# EAGLE board wordclock-r3-4x6 (EAGLE 5.11), part 1 of 2
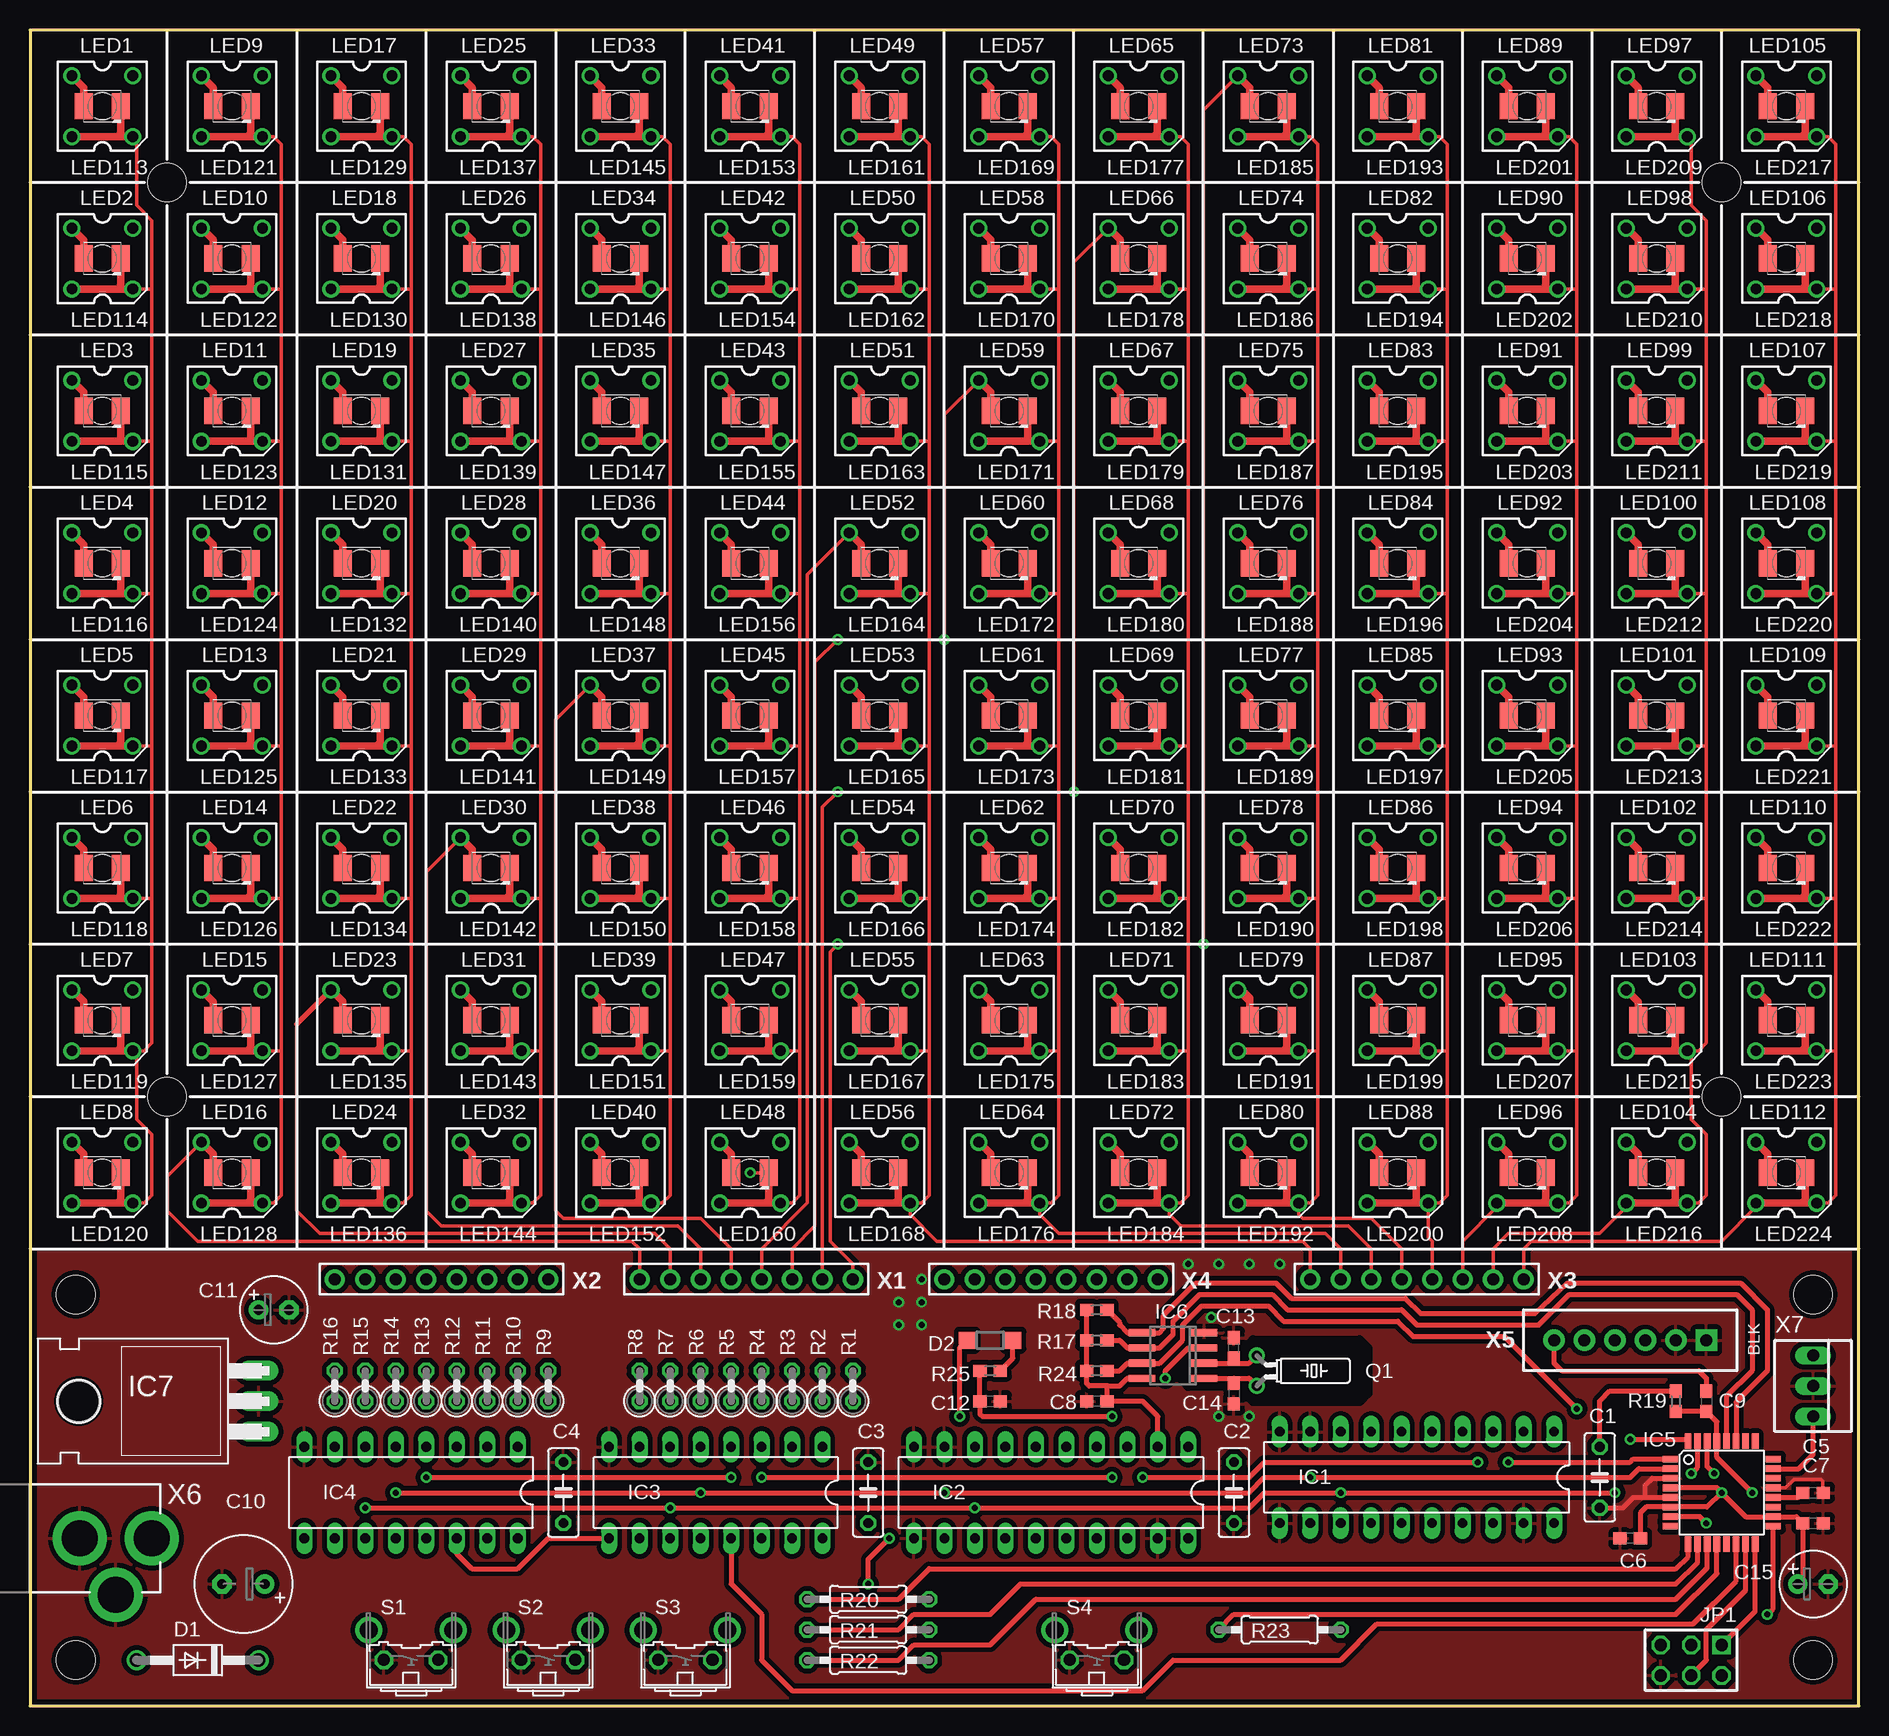
[diagram p2: board, top side]
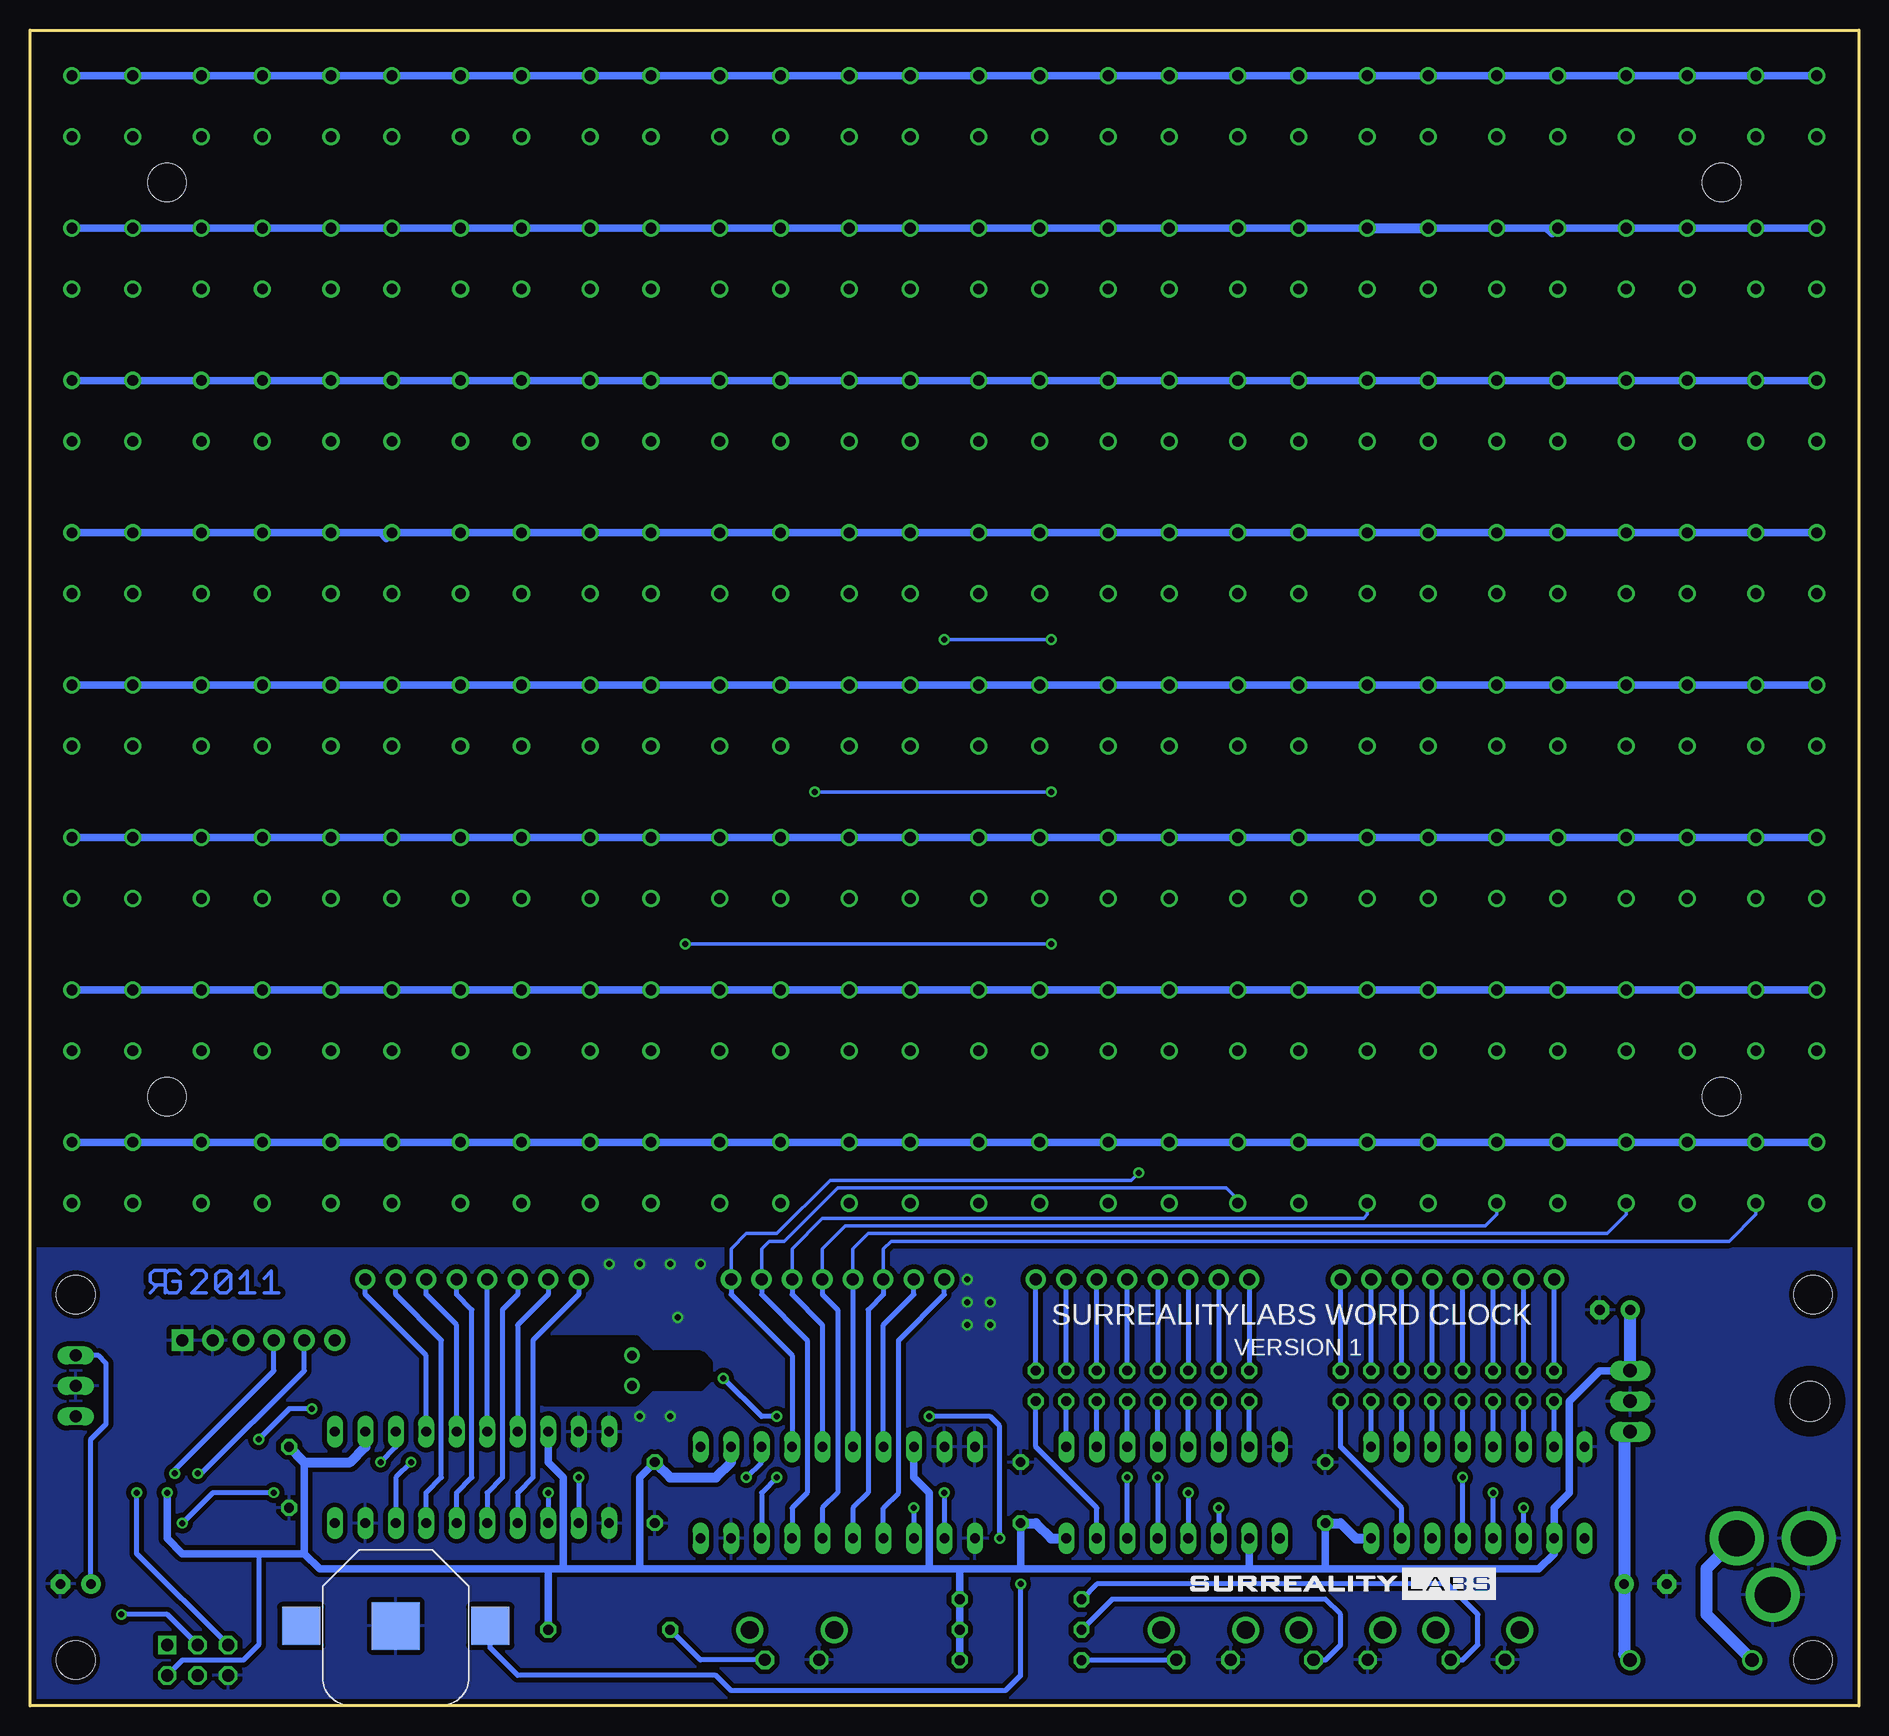
[diagram p3: board, bottom side, seen from below]

Size 152.4 x 139.7 mm. Coordinates in mm from the lower left corner, seen from the top.
Outline: 0,139.7 0,0 152.4,0 152.4,139.7 0,139.7
Copper layers (1*16): Top 0.035mm / dielectric 1.5mm / Bottom 0.035mm
Design rules "default *": minimum track width 10mil, minimum drill 19mil, track to track 10mil, track to pad 10mil, pad to pad 10mil, via to via 10mil, smd to smd 10mil, copper to edge 10mil, drill to drill 8mil, minimum pad ring 10mil, minimum via ring 8mil, stop-mask expansion 4mil, vias tented up to drill 20mil, thermal gap 16mil
Holes 3.2 mm at 3.81,34.29 148.59,34.29 148.59,3.81 3.81,3.81 11.43,50.8 140.97,50.8 140.97,127 11.43,127
tRestrict: 12 lines
bRestrict: 12 lines

## Footprints (pad centres in the part's own frame; a part is rotated, then mirrored left to right if it is on the bottom)
BATTCON_12MM = smd 3.962 x 3.962: GND 0,0 | smd 3.175 x 3.175: PWR@1 -7.874,0; PWR@2 7.874,0
C050-025X075 = drill 0.813 octagon: 1 -2.54,0; 2 2.54,0
C0603 = smd 1.1 x 1: 1 -0.85,0; 2 0.85,0
E3,5-8 = drill 0.813 pad 1.6 round: + -1.778,0 | drill 0.813 pad 1.6 octagon: - 1.778,0
E2,5-6 = drill 0.813 pad 1.6 round: + -1.27,0 | drill 0.813 pad 1.6 octagon: - 1.27,0
DO41-10 = drill 1.118 round: A 5.08,0; C -5.08,0
SOD123 = smd 1.4 x 1.4: A 1.9,0; C -1.9,0
DIL20 = drill 0.813 long: 1 -11.43,-3.81; 2 -8.89,-3.81; 3 -6.35,-3.81; 4 -3.81,-3.81; 5 -1.27,-3.81; 6 1.27,-3.81; 7 3.81,-3.81; 8 6.35,-3.81; 9 8.89,-3.81; 10 11.43,-3.81; 11 11.43,3.81; 12 8.89,3.81; 13 6.35,3.81; 14 3.81,3.81; 15 1.27,3.81; 16 -1.27,3.81; 17 -3.81,3.81; 18 -6.35,3.81; 19 -8.89,3.81; 20 -11.43,3.81
DIL16 = drill 0.813 long: 1 -8.89,-3.81; 2 -6.35,-3.81; 3 -3.81,-3.81; 4 -1.27,-3.81; 5 1.27,-3.81; 6 3.81,-3.81; 7 6.35,-3.81; 8 8.89,-3.81; 9 8.89,3.81; 10 6.35,3.81; 11 3.81,3.81; 12 1.27,3.81; 13 -1.27,3.81; 14 -3.81,3.81; 15 -6.35,3.81; 16 -8.89,3.81
TQFP32-08 = smd 1.27 x 0.559: 1 -4.293,2.8; 2 -4.293,2; 3 -4.293,1.2; 4 -4.293,0.4; 5 -4.293,-0.4; 6 -4.293,-1.2; 7 -4.293,-2; 8 -4.293,-2.8; 17 4.293,-2.8; 18 4.293,-2; 19 4.293,-1.2; 20 4.293,-0.4; 21 4.293,0.4; 22 4.293,1.2; 23 4.293,2; 24 4.293,2.8 | smd 0.559 x 1.27: 9 -2.8,-4.293; 10 -2,-4.293; 11 -1.2,-4.293; 12 -0.4,-4.293; 13 0.4,-4.293; 14 1.2,-4.293; 15 2,-4.293; 16 2.8,-4.293; 25 2.8,4.293; 26 2,4.293; 27 1.2,4.293; 28 0.4,4.293; 29 -0.4,4.293; 30 -1.2,4.293; 31 -2,4.293; 32 -2.8,4.293
SOIC8 = smd 0.6 x 2.2: 1 -1.905,-2.6; 2 -0.635,-2.6; 3 0.635,-2.6; 4 1.905,-2.6; 5 1.905,2.6; 6 0.635,2.6; 7 -0.635,2.6; 8 -1.905,2.6
TO220H = drill 1.118 long: 1 -2.54,-10.16; 2 0,-10.16; 3 2.54,-10.16 | hole 3.302: 0,4.826
AVR-ISP-6 = drill 1.016 square: 1 -2.54,-1.27 | drill 1.016 octagon: 2 -2.54,1.27; 3 0,-1.27; 4 0,1.27; 5 2.54,-1.27; 6 2.54,1.27
KA-3528ASYC = smd 1.5 x 2.2: A -1.55,0; C 1.55,0
SUPERFLUX-7.6X7.6 = drill 0.9 pad 1.422 round: 1 -2.54,2.54; 2 2.54,2.54; 3 -2.54,-2.54; 4 2.54,-2.54
TC26H = drill 0.813 round: 1 -1.27,0; 2 1.27,0
0207/2V = drill 0.813 octagon: 1 -1.27,0; 2 1.27,0
R0603 = smd 1.1 x 1: 1 -0.85,0; 2 0.85,0
0207/10 = drill 0.813 octagon: 1 -5.08,0; 2 5.08,0
B3F-31XX = drill 1.016 octagon: 1 -2.261,-1.245; 2 2.261,-1.245 | drill 1.499 pad 2.159 round: 3 -3.505,1.245; 4 3.505,1.245
100MIL-8 = drill 1 pad 1.676 round: 1 -8.89,0; 2 -6.35,0; 3 -3.81,0; 4 -1.27,0; 5 1.27,0; 6 3.81,0; 7 6.35,0; 8 8.89,0
USBCABLE-0.100-NOLBL = drill 1 pad 1.778 square: 1 0,-7.62 | drill 1 pad 1.778 round: 2 0,-5.08; 3 0,-2.54; 4 0,0; 5 0,2.54; 6 0,5.08
PJ-002 = drill 3 pad 4.5 round: 1 0,0; 2 0,6; 3 -4.7,3
22-23-2031 = drill 1 long: 1 -2.54,0; 2 0,0; 3 2.54,0

## Placement (x,y rotation side)
BAT1  [BATTCON_12MM]  121.92,6.67 180 bottom
C1  [C050-025X075]  130.81,19.05 270 top
C2  [C050-025X075]  100.33,17.78 270 top
C3  [C050-025X075]  69.85,17.78 90 top
C4  [C050-025X075]  44.45,17.78 90 top
C5  [C0603]  148.59,17.78 0 top
C6  [C0603]  133.35,13.97 180 top
C7  [C0603]  148.59,15.24 0 top
C8  [C0603]  88.9,25.4 180 top
C9  [C0603]  139.7,25.4 270 top
C10  100u  [E3,5-8]  17.78,10.16 180 top
C11  10u  [E2,5-6]  20.32,33.02 0 top
C12  [C0603]  80.01,25.4 0 top
C13  8p  [C0603]  100.33,29.84 90 top
C14  10p  [C0603]  100.33,26.04 270 top
C15  10u  [E2,5-6]  148.59,10.16 0 top
D1  1N4004  [DO41-10]  13.97,3.81 180 top
D2  MBR0520LT  [SOD123]  80.01,30.48 180 top
IC1  TPIC6B595  [DIL20]  115.57,19.05 180 top
IC2  TPIC6B595  [DIL20]  85.09,17.78 180 top
IC3  74HC595N  [DIL16]  57.15,17.78 180 top
IC4  74HC595N  [DIL16]  31.75,17.78 180 top
IC5  MEGA48/88/168-AU  [TQFP32-08]  140.97,17.78 0 top
IC6  DS1307Z  [SOIC8]  95.25,29.21 90 top
IC7  7805T  [TO220H]  8.89,25.4 90 top
JP1  AVR-ISP-6  [AVR-ISP-6]  138.43,3.81 180 top
LED1  [KA-3528ASYC]  6.03,133.35 0 top
LED2  [KA-3528ASYC]  6.03,120.65 0 top
LED3  [KA-3528ASYC]  6.03,107.95 0 top
LED4  [KA-3528ASYC]  6.03,95.25 0 top
LED5  [KA-3528ASYC]  6.03,82.55 0 top
LED6  [KA-3528ASYC]  6.03,69.85 0 top
LED7  [KA-3528ASYC]  6.03,57.15 0 top
LED8  [KA-3528ASYC]  6.03,44.45 0 top
LED9  [KA-3528ASYC]  16.83,133.35 0 top
LED10  [KA-3528ASYC]  16.83,120.65 0 top
LED11  [KA-3528ASYC]  16.83,107.95 0 top
LED12  [KA-3528ASYC]  16.83,95.25 0 top
LED13  [KA-3528ASYC]  16.83,82.55 0 top
LED14  [KA-3528ASYC]  16.83,69.85 0 top
LED15  [KA-3528ASYC]  16.83,57.15 0 top
LED16  [KA-3528ASYC]  16.83,44.45 0 top
LED17  [KA-3528ASYC]  27.62,133.35 0 top
LED18  [KA-3528ASYC]  27.62,120.65 0 top
LED19  [KA-3528ASYC]  27.62,107.95 0 top
LED20  [KA-3528ASYC]  27.62,95.25 0 top
LED21  [KA-3528ASYC]  27.62,82.55 0 top
LED22  [KA-3528ASYC]  27.62,69.85 0 top
LED23  [KA-3528ASYC]  27.62,57.15 0 top
LED24  [KA-3528ASYC]  27.62,44.45 0 top
LED25  [KA-3528ASYC]  38.42,133.35 0 top
LED26  [KA-3528ASYC]  38.42,120.65 0 top
LED27  [KA-3528ASYC]  38.42,107.95 0 top
LED28  [KA-3528ASYC]  38.42,95.25 0 top
LED29  [KA-3528ASYC]  38.42,82.55 0 top
LED30  [KA-3528ASYC]  38.42,69.85 0 top
LED31  [KA-3528ASYC]  38.42,57.15 0 top
LED32  [KA-3528ASYC]  38.42,44.45 0 top
LED33  [KA-3528ASYC]  49.21,133.35 0 top
LED34  [KA-3528ASYC]  49.21,120.65 0 top
LED35  [KA-3528ASYC]  49.21,107.95 0 top
LED36  [KA-3528ASYC]  49.21,95.25 0 top
LED37  [KA-3528ASYC]  49.21,82.55 0 top
LED38  [KA-3528ASYC]  49.21,69.85 0 top
LED39  [KA-3528ASYC]  49.21,57.15 0 top
LED40  [KA-3528ASYC]  49.21,44.45 0 top
LED41  [KA-3528ASYC]  60.01,133.35 0 top
LED42  [KA-3528ASYC]  60.01,120.65 0 top
LED43  [KA-3528ASYC]  60.01,107.95 0 top
LED44  [KA-3528ASYC]  60.01,95.25 0 top
LED45  [KA-3528ASYC]  60.01,82.55 0 top
LED46  [KA-3528ASYC]  60.01,69.85 0 top
LED47  [KA-3528ASYC]  60.01,57.15 0 top
LED48  [KA-3528ASYC]  60.01,44.45 0 top
LED49  [KA-3528ASYC]  70.8,133.35 0 top
LED50  [KA-3528ASYC]  70.8,120.65 0 top
LED51  [KA-3528ASYC]  70.8,107.95 0 top
LED52  [KA-3528ASYC]  70.8,95.25 0 top
LED53  [KA-3528ASYC]  70.8,82.55 0 top
LED54  [KA-3528ASYC]  70.8,69.85 0 top
LED55  [KA-3528ASYC]  70.8,57.15 0 top
LED56  [KA-3528ASYC]  70.8,44.45 0 top
LED57  [KA-3528ASYC]  81.6,133.35 0 top
LED58  [KA-3528ASYC]  81.6,120.65 0 top
LED59  [KA-3528ASYC]  81.6,107.95 0 top
LED60  [KA-3528ASYC]  81.6,95.25 0 top
LED61  [KA-3528ASYC]  81.6,82.55 0 top
LED62  [KA-3528ASYC]  81.6,69.85 0 top
LED63  [KA-3528ASYC]  81.6,57.15 0 top
LED64  [KA-3528ASYC]  81.6,44.45 0 top
LED65  [KA-3528ASYC]  92.39,133.35 0 top
LED66  [KA-3528ASYC]  92.39,120.65 0 top
LED67  [KA-3528ASYC]  92.39,107.95 0 top
LED68  [KA-3528ASYC]  92.39,95.25 0 top
LED69  [KA-3528ASYC]  92.39,82.55 0 top
LED70  [KA-3528ASYC]  92.39,69.85 0 top
LED71  [KA-3528ASYC]  92.39,57.15 0 top
LED72  [KA-3528ASYC]  92.39,44.45 0 top
LED73  [KA-3528ASYC]  103.19,133.35 0 top
LED74  [KA-3528ASYC]  103.19,120.65 0 top
LED75  [KA-3528ASYC]  103.19,107.95 0 top
LED76  [KA-3528ASYC]  103.19,95.25 0 top
LED77  [KA-3528ASYC]  103.19,82.55 0 top
LED78  [KA-3528ASYC]  103.19,69.85 0 top
LED79  [KA-3528ASYC]  103.19,57.15 0 top
LED80  [KA-3528ASYC]  103.19,44.45 0 top
LED81  [KA-3528ASYC]  113.98,133.35 0 top
LED82  [KA-3528ASYC]  113.98,120.65 0 top
LED83  [KA-3528ASYC]  113.98,107.95 0 top
LED84  [KA-3528ASYC]  113.98,95.25 0 top
LED85  [KA-3528ASYC]  113.98,82.55 0 top
LED86  [KA-3528ASYC]  113.98,69.85 0 top
LED87  [KA-3528ASYC]  113.98,57.15 0 top
LED88  [KA-3528ASYC]  113.98,44.45 0 top
LED89  [KA-3528ASYC]  124.78,133.35 0 top
LED90  [KA-3528ASYC]  124.78,120.65 0 top
LED91  [KA-3528ASYC]  124.78,107.95 0 top
LED92  [KA-3528ASYC]  124.78,95.25 0 top
LED93  [KA-3528ASYC]  124.78,82.55 0 top
LED94  [KA-3528ASYC]  124.78,69.85 0 top
LED95  [KA-3528ASYC]  124.78,57.15 0 top
LED96  [KA-3528ASYC]  124.78,44.45 0 top
LED97  [KA-3528ASYC]  135.57,133.35 0 top
LED98  [KA-3528ASYC]  135.57,120.65 0 top
LED99  [KA-3528ASYC]  135.57,107.95 0 top
LED100  [KA-3528ASYC]  135.57,95.25 0 top
LED101  [KA-3528ASYC]  135.57,82.55 0 top
LED102  [KA-3528ASYC]  135.57,69.85 0 top
LED103  [KA-3528ASYC]  135.57,57.15 0 top
LED104  [KA-3528ASYC]  135.57,44.45 0 top
LED105  [KA-3528ASYC]  146.37,133.35 0 top
LED106  [KA-3528ASYC]  146.37,120.65 0 top
LED107  [KA-3528ASYC]  146.37,107.95 0 top
LED108  [KA-3528ASYC]  146.37,95.25 0 top
LED109  [KA-3528ASYC]  146.37,82.55 0 top
LED110  [KA-3528ASYC]  146.37,69.85 0 top
LED111  [KA-3528ASYC]  146.37,57.15 0 top
LED112  [KA-3528ASYC]  146.37,44.45 0 top
LED113  [SUPERFLUX-7.6X7.6]  6.03,133.35 90 top
LED114  [SUPERFLUX-7.6X7.6]  6.03,120.65 90 top
LED115  [SUPERFLUX-7.6X7.6]  6.03,107.95 90 top
LED116  [SUPERFLUX-7.6X7.6]  6.03,95.25 90 top
LED117  [SUPERFLUX-7.6X7.6]  6.03,82.55 90 top
LED118  [SUPERFLUX-7.6X7.6]  6.03,69.85 90 top
LED119  [SUPERFLUX-7.6X7.6]  6.03,57.15 90 top
LED120  [SUPERFLUX-7.6X7.6]  6.03,44.45 90 top
LED121  [SUPERFLUX-7.6X7.6]  16.83,133.35 90 top
LED122  [SUPERFLUX-7.6X7.6]  16.83,120.65 90 top
LED123  [SUPERFLUX-7.6X7.6]  16.83,107.95 90 top
LED124  [SUPERFLUX-7.6X7.6]  16.83,95.25 90 top
LED125  [SUPERFLUX-7.6X7.6]  16.83,82.55 90 top
LED126  [SUPERFLUX-7.6X7.6]  16.83,69.85 90 top
LED127  [SUPERFLUX-7.6X7.6]  16.83,57.15 90 top
LED128  [SUPERFLUX-7.6X7.6]  16.83,44.45 90 top
LED129  [SUPERFLUX-7.6X7.6]  27.62,133.35 90 top
LED130  [SUPERFLUX-7.6X7.6]  27.62,120.65 90 top
LED131  [SUPERFLUX-7.6X7.6]  27.62,107.95 90 top
LED132  [SUPERFLUX-7.6X7.6]  27.62,95.25 90 top
LED133  [SUPERFLUX-7.6X7.6]  27.62,82.55 90 top
LED134  [SUPERFLUX-7.6X7.6]  27.62,69.85 90 top
LED135  [SUPERFLUX-7.6X7.6]  27.62,57.15 90 top
LED136  [SUPERFLUX-7.6X7.6]  27.62,44.45 90 top
LED137  [SUPERFLUX-7.6X7.6]  38.42,133.35 90 top
LED138  [SUPERFLUX-7.6X7.6]  38.42,120.65 90 top
LED139  [SUPERFLUX-7.6X7.6]  38.42,107.95 90 top
LED140  [SUPERFLUX-7.6X7.6]  38.42,95.25 90 top
LED141  [SUPERFLUX-7.6X7.6]  38.42,82.55 90 top
LED142  [SUPERFLUX-7.6X7.6]  38.42,69.85 90 top
LED143  [SUPERFLUX-7.6X7.6]  38.42,57.15 90 top
LED144  [SUPERFLUX-7.6X7.6]  38.42,44.45 90 top
LED145  [SUPERFLUX-7.6X7.6]  49.21,133.35 90 top
LED146  [SUPERFLUX-7.6X7.6]  49.21,120.65 90 top
LED147  [SUPERFLUX-7.6X7.6]  49.21,107.95 90 top
LED148  [SUPERFLUX-7.6X7.6]  49.21,95.25 90 top
LED149  [SUPERFLUX-7.6X7.6]  49.21,82.55 90 top
LED150  [SUPERFLUX-7.6X7.6]  49.21,69.85 90 top
LED151  [SUPERFLUX-7.6X7.6]  49.21,57.15 90 top
LED152  [SUPERFLUX-7.6X7.6]  49.21,44.45 90 top
LED153  [SUPERFLUX-7.6X7.6]  60.01,133.35 90 top
LED154  [SUPERFLUX-7.6X7.6]  60.01,120.65 90 top
LED155  [SUPERFLUX-7.6X7.6]  60.01,107.95 90 top
LED156  [SUPERFLUX-7.6X7.6]  60.01,95.25 90 top
LED157  [SUPERFLUX-7.6X7.6]  60.01,82.55 90 top
LED158  [SUPERFLUX-7.6X7.6]  60.01,69.85 90 top
LED159  [SUPERFLUX-7.6X7.6]  60.01,57.15 90 top
LED160  [SUPERFLUX-7.6X7.6]  60.01,44.45 90 top
LED161  [SUPERFLUX-7.6X7.6]  70.8,133.35 90 top
LED162  [SUPERFLUX-7.6X7.6]  70.8,120.65 90 top
LED163  [SUPERFLUX-7.6X7.6]  70.8,107.95 90 top
LED164  [SUPERFLUX-7.6X7.6]  70.8,95.25 90 top
LED165  [SUPERFLUX-7.6X7.6]  70.8,82.55 90 top
LED166  [SUPERFLUX-7.6X7.6]  70.8,69.85 90 top
LED167  [SUPERFLUX-7.6X7.6]  70.8,57.15 90 top
LED168  [SUPERFLUX-7.6X7.6]  70.8,44.45 90 top
LED169  [SUPERFLUX-7.6X7.6]  81.6,133.35 90 top
LED170  [SUPERFLUX-7.6X7.6]  81.6,120.65 90 top
LED171  [SUPERFLUX-7.6X7.6]  81.6,107.95 90 top
LED172  [SUPERFLUX-7.6X7.6]  81.6,95.25 90 top
LED173  [SUPERFLUX-7.6X7.6]  81.6,82.55 90 top
LED174  [SUPERFLUX-7.6X7.6]  81.6,69.85 90 top
LED175  [SUPERFLUX-7.6X7.6]  81.6,57.15 90 top
LED176  [SUPERFLUX-7.6X7.6]  81.6,44.45 90 top
LED177  [SUPERFLUX-7.6X7.6]  92.39,133.35 90 top
LED178  [SUPERFLUX-7.6X7.6]  92.39,120.65 90 top
LED179  [SUPERFLUX-7.6X7.6]  92.39,107.95 90 top
LED180  [SUPERFLUX-7.6X7.6]  92.39,95.25 90 top
LED181  [SUPERFLUX-7.6X7.6]  92.39,82.55 90 top
LED182  [SUPERFLUX-7.6X7.6]  92.39,69.85 90 top
LED183  [SUPERFLUX-7.6X7.6]  92.39,57.15 90 top
LED184  [SUPERFLUX-7.6X7.6]  92.39,44.45 90 top
LED185  [SUPERFLUX-7.6X7.6]  103.19,133.35 90 top
LED186  [SUPERFLUX-7.6X7.6]  103.19,120.65 90 top
LED187  [SUPERFLUX-7.6X7.6]  103.19,107.95 90 top
LED188  [SUPERFLUX-7.6X7.6]  103.19,95.25 90 top
LED189  [SUPERFLUX-7.6X7.6]  103.19,82.55 90 top
LED190  [SUPERFLUX-7.6X7.6]  103.19,69.85 90 top
LED191  [SUPERFLUX-7.6X7.6]  103.19,57.15 90 top
LED192  [SUPERFLUX-7.6X7.6]  103.19,44.45 90 top
LED193  [SUPERFLUX-7.6X7.6]  113.98,133.35 90 top
LED194  [SUPERFLUX-7.6X7.6]  113.98,120.65 90 top
LED195  [SUPERFLUX-7.6X7.6]  113.98,107.95 90 top
LED196  [SUPERFLUX-7.6X7.6]  113.98,95.25 90 top
LED197  [SUPERFLUX-7.6X7.6]  113.98,82.55 90 top
LED198  [SUPERFLUX-7.6X7.6]  113.98,69.85 90 top
LED199  [SUPERFLUX-7.6X7.6]  113.98,57.15 90 top
LED200  [SUPERFLUX-7.6X7.6]  113.98,44.45 90 top
LED201  [SUPERFLUX-7.6X7.6]  124.78,133.35 90 top
LED202  [SUPERFLUX-7.6X7.6]  124.78,120.65 90 top
LED203  [SUPERFLUX-7.6X7.6]  124.78,107.95 90 top
LED204  [SUPERFLUX-7.6X7.6]  124.78,95.25 90 top
LED205  [SUPERFLUX-7.6X7.6]  124.78,82.55 90 top
LED206  [SUPERFLUX-7.6X7.6]  124.78,69.85 90 top
LED207  [SUPERFLUX-7.6X7.6]  124.78,57.15 90 top
LED208  [SUPERFLUX-7.6X7.6]  124.78,44.45 90 top
LED209  [SUPERFLUX-7.6X7.6]  135.57,133.35 90 top
LED210  [SUPERFLUX-7.6X7.6]  135.57,120.65 90 top
LED211  [SUPERFLUX-7.6X7.6]  135.57,107.95 90 top
LED212  [SUPERFLUX-7.6X7.6]  135.57,95.25 90 top
LED213  [SUPERFLUX-7.6X7.6]  135.57,82.55 90 top
LED214  [SUPERFLUX-7.6X7.6]  135.57,69.85 90 top
LED215  [SUPERFLUX-7.6X7.6]  135.57,57.15 90 top
LED216  [SUPERFLUX-7.6X7.6]  135.57,44.45 90 top
LED217  [SUPERFLUX-7.6X7.6]  146.37,133.35 90 top
LED218  [SUPERFLUX-7.6X7.6]  146.37,120.65 90 top
LED219  [SUPERFLUX-7.6X7.6]  146.37,107.95 90 top
LED220  [SUPERFLUX-7.6X7.6]  146.37,95.25 90 top
LED221  [SUPERFLUX-7.6X7.6]  146.37,82.55 90 top
LED222  [SUPERFLUX-7.6X7.6]  146.37,69.85 90 top
LED223  [SUPERFLUX-7.6X7.6]  146.37,57.15 90 top
LED224  [SUPERFLUX-7.6X7.6]  146.37,44.45 90 top
Q1  [TC26H]  102.23,27.94 270 top
R1  [0207/2V]  68.58,26.67 90 top
R2  [0207/2V]  66.04,26.67 90 top
R3  [0207/2V]  63.5,26.67 90 top
R4  [0207/2V]  60.96,26.67 90 top
R5  [0207/2V]  58.42,26.67 90 top
R6  [0207/2V]  55.88,26.67 90 top
R7  [0207/2V]  53.34,26.67 90 top
R8  [0207/2V]  50.8,26.67 90 top
R9  [0207/2V]  43.18,26.67 90 top
R10  [0207/2V]  40.64,26.67 90 top
R11  [0207/2V]  38.1,26.67 90 top
R12  [0207/2V]  35.56,26.67 90 top
R13  [0207/2V]  33.02,26.67 90 top
R14  [0207/2V]  30.48,26.67 90 top
R15  [0207/2V]  27.94,26.67 90 top
R16  [0207/2V]  25.4,26.67 90 top
R17  [R0603]  88.9,30.48 180 top
R18  [R0603]  88.9,33.02 180 top
R19  [R0603]  137.16,25.4 90 top
R20  [0207/10]  69.85,8.89 0 top
R21  [0207/10]  69.85,6.35 0 top
R22  [0207/10]  69.85,3.81 0 top
R23  [0207/10]  104.14,6.35 0 top
R24  [R0603]  88.9,27.94 180 top
R25  [R0603]  80.01,27.94 0 top
S1  [B3F-31XX]  31.75,5.08 0 top
S2  [B3F-31XX]  43.18,5.08 0 top
S3  [B3F-31XX]  54.61,5.08 0 top
S4  [B3F-31XX]  88.9,5.08 0 top
U$1  [RGLOGO_SMALL_2011]  140.97,34.29 0 bottom
U$2  [SURREALITY_LOGO_SILK]  55.88,8.89 0 bottom
X1  M08-100MIL  [100MIL-8]  59.69,35.56 180 top
X2  M08-100MIL  [100MIL-8]  34.29,35.56 180 top
X3  M08-100MIL  [100MIL-8]  115.57,35.56 180 top
X4  M08-100MIL  [100MIL-8]  85.09,35.56 180 top
X5  TTL-232R-5VN  [USBCABLE-0.100-NOLBL]  132.08,30.48 90 top
X6  PJ-002B  [PJ-002]  10.16,13.97 90 top
X7  22-23-2031  [22-23-2031]  148.59,26.67 270 top